# EAGLE schematic axoloti_shield_example (EAGLE 7.3.0)
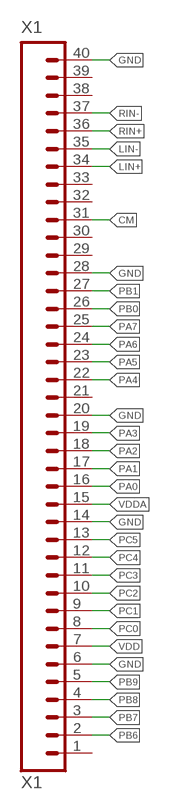
[diagram p0: schematic, sheet 1]

## Parts
X1  X1  M40  [1X40]

## Nets
CM: X1.31
GND: X1.6 X1.14 X1.20 X1.28 X1.40
LIN+: X1.34
LIN-: X1.35
PA0: X1.16
PA1: X1.17
PA2: X1.18
PA3: X1.19
PA4: X1.22
PA5: X1.23
PA6: X1.24
PA7: X1.25
PB0: X1.26
PB1: X1.27
PB6: X1.2
PB7: X1.3
PB8: X1.4
PB9: X1.5
PC0: X1.8
PC1: X1.9
PC2: X1.10
PC3: X1.11
PC4: X1.12
PC5: X1.13
RIN+: X1.36
RIN-: X1.37
VDD: X1.7
VDDA: X1.15
Unconnected: X1.1 X1.21 X1.29 X1.30 X1.32 X1.33 X1.38 X1.39

## Library data of the parts
X1 = SparkFun-Connectors:M40: 1x40 .1" header

## Net classes
0 default: width 0.305 mm